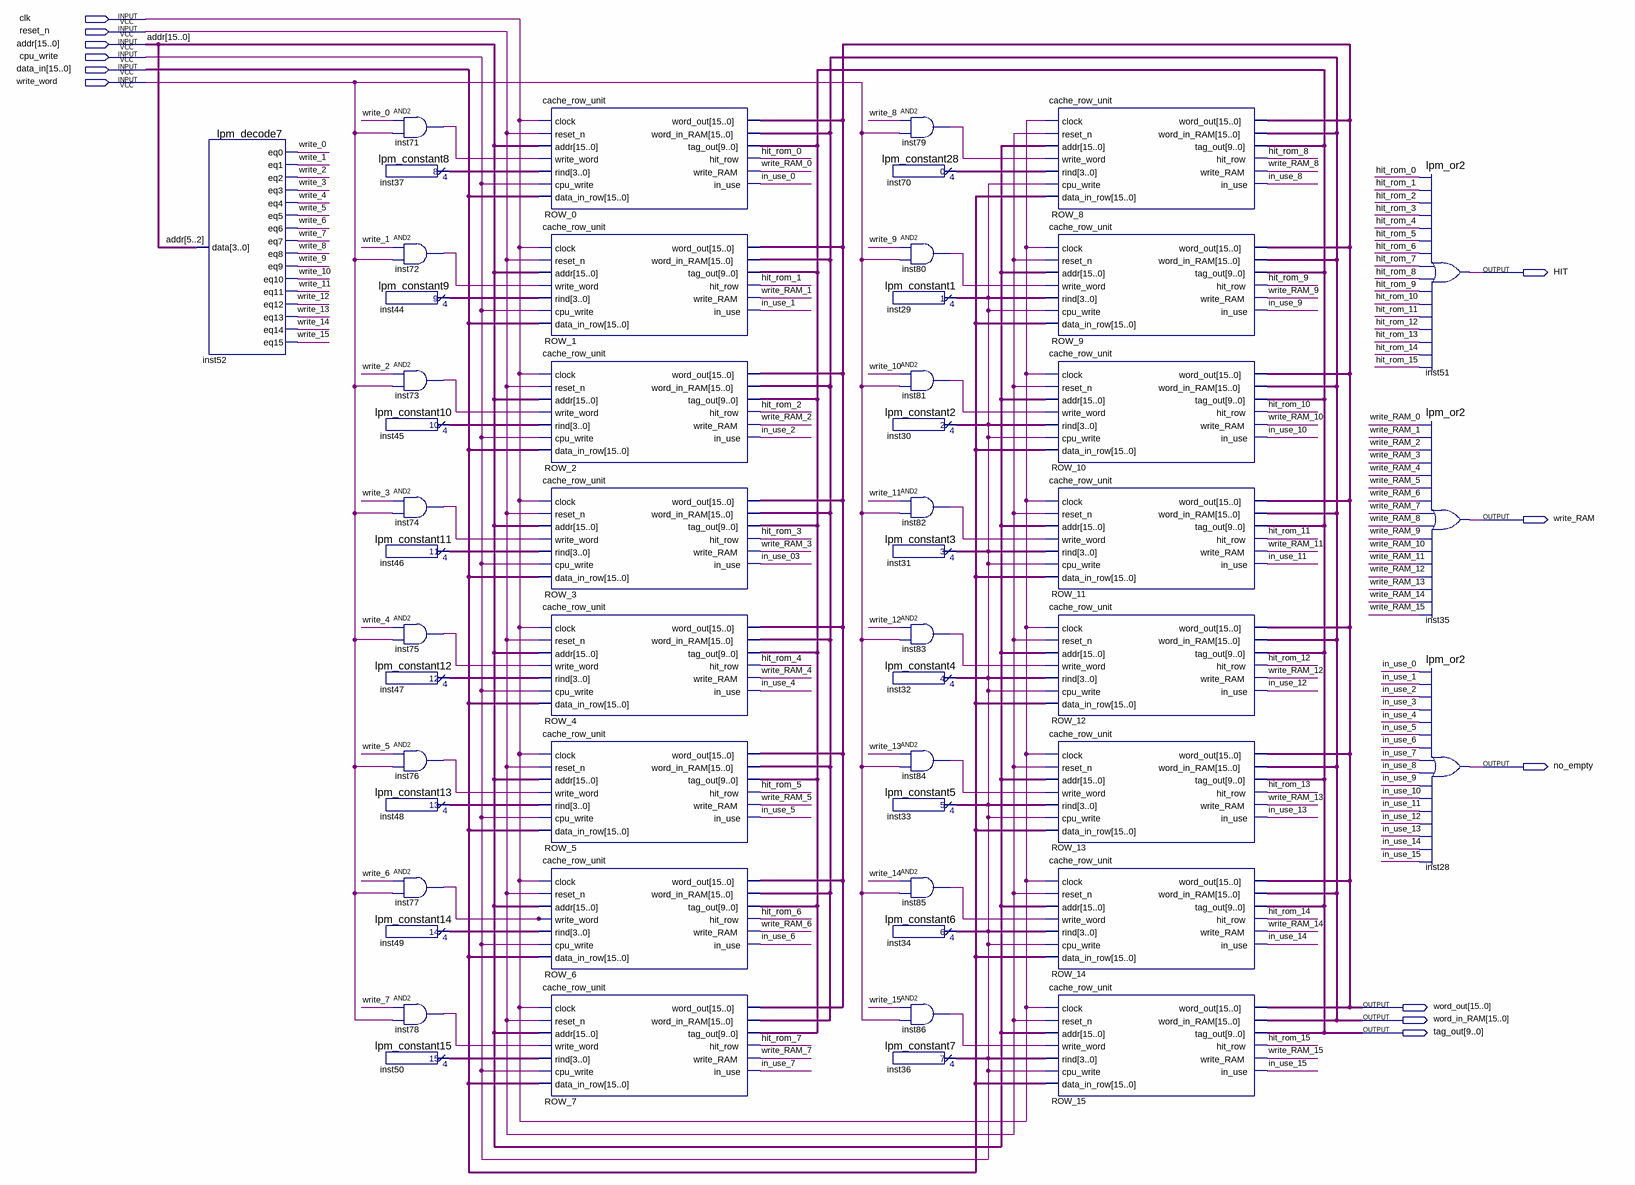
[diagram p0: schematic sheet]
// Quartus schematic cache_bank_unit.bdf as structural Verilog: 52 symbols, 12 pins
module cache_bank_unit (
  input  clk,
  input  reset_n,
  input  [15:0] addr,
  input  cpu_write,
  input  [15:0] data_in,
  input  write_word,
  output HIT,
  output write_RAM,
  output no_empty,
  output [15:0] word_out,
  output [15:0] word_in_RAM,
  output [9:0] tag_out
);

  wire hit_rom_0, hit_rom_1, hit_rom_2, hit_rom_3, hit_rom_4, hit_rom_5, hit_rom_6, hit_rom_7, hit_rom_8,
       hit_rom_9, hit_rom_10, hit_rom_11, hit_rom_12, hit_rom_13, hit_rom_14, hit_rom_15, in_use_0, in_use_1,
       in_use_2, in_use_03, in_use_3, in_use_4, in_use_5, in_use_6, in_use_7, in_use_8, in_use_9, in_use_10,
       in_use_11, in_use_12, in_use_13, in_use_14, in_use_15, inst71_out, inst72_out, inst73_out, inst74_out,
       inst75_out, inst76_out, inst77_out, inst78_out, inst79_out, inst80_out, inst81_out, inst82_out,
       inst83_out, inst84_out, inst85_out, inst86_out, write_0, write_1, write_2, write_3, write_4, write_5,
       write_6, write_7, write_8, write_9, write_10, write_11, write_12, write_13, write_14, write_15,
       write_RAM_0, write_RAM_1, write_RAM_2, write_RAM_3, write_RAM_4, write_RAM_5, write_RAM_6,
       write_RAM_7, write_RAM_8, write_RAM_9, write_RAM_10, write_RAM_11, write_RAM_12, write_RAM_13,
       write_RAM_14, write_RAM_15;
  wire [3:0] inst29_result, inst30_result, inst31_result, inst32_result, inst33_result, inst34_result,
       inst36_result, inst37_result, inst44_result, inst45_result, inst46_result, inst47_result,
       inst48_result, inst49_result, inst50_result, inst70_result;

  lpm_decode7 inst52 (
    .data(addr[5:2]), .eq0(write_0), .eq1(write_1), .eq2(write_2), .eq3(write_3), .eq4(write_4),
    .eq5(write_5), .eq6(write_6), .eq7(write_7), .eq8(write_8), .eq9(write_9), .eq10(write_10),
    .eq11(write_11), .eq12(write_12), .eq13(write_13), .eq14(write_14), .eq15(write_15));
  and inst71 (inst71_out, write_0, write_word);
  lpm_constant8 inst37 (.result(inst37_result));
  and inst72 (inst72_out, write_1, write_word);
  lpm_constant9 inst44 (.result(inst44_result));
  and inst73 (inst73_out, write_2, write_word);
  lpm_constant10 inst45 (.result(inst45_result));
  and inst74 (inst74_out, write_3, write_word);
  lpm_constant11 inst46 (.result(inst46_result));
  and inst75 (inst75_out, write_4, write_word);
  lpm_constant12 inst47 (.result(inst47_result));
  and inst76 (inst76_out, write_5, write_word);
  lpm_constant13 inst48 (.result(inst48_result));
  and inst77 (inst77_out, write_6, write_word);
  lpm_constant14 inst49 (.result(inst49_result));
  and inst78 (inst78_out, write_7, write_word);
  lpm_constant15 inst50 (.result(inst50_result));
  cache_row_unit ROW_0 (
    .clock(clk), .reset_n(reset_n), .addr(addr), .write_word(inst71_out), .rind(inst37_result),
    .cpu_write(cpu_write), .data_in_row(data_in), .word_out(word_out), .word_in_RAM(word_in_RAM),
    .tag_out(tag_out), .hit_row(hit_rom_0), .write_RAM(write_RAM_0), .in_use(in_use_0));
  cache_row_unit ROW_1 (
    .clock(clk), .reset_n(reset_n), .addr(addr), .write_word(inst72_out), .rind(inst44_result),
    .cpu_write(cpu_write), .data_in_row(data_in), .word_out(word_out), .word_in_RAM(word_in_RAM),
    .tag_out(tag_out), .hit_row(hit_rom_1), .write_RAM(write_RAM_1), .in_use(in_use_1));
  cache_row_unit ROW_2 (
    .clock(clk), .reset_n(reset_n), .addr(addr), .write_word(inst73_out), .rind(inst45_result),
    .cpu_write(cpu_write), .data_in_row(data_in), .word_out(word_out), .word_in_RAM(word_in_RAM),
    .tag_out(tag_out), .hit_row(hit_rom_2), .write_RAM(write_RAM_2), .in_use(in_use_2));
  cache_row_unit ROW_3 (
    .clock(clk), .reset_n(reset_n), .addr(addr), .write_word(inst74_out), .rind(inst46_result),
    .cpu_write(cpu_write), .data_in_row(data_in), .word_out(word_out), .word_in_RAM(word_in_RAM),
    .tag_out(tag_out), .hit_row(hit_rom_3), .write_RAM(write_RAM_3), .in_use(in_use_03));
  cache_row_unit ROW_4 (
    .clock(clk), .reset_n(reset_n), .addr(addr), .write_word(inst75_out), .rind(inst47_result),
    .cpu_write(cpu_write), .data_in_row(data_in), .word_out(word_out), .word_in_RAM(word_in_RAM),
    .tag_out(tag_out), .hit_row(hit_rom_4), .write_RAM(write_RAM_4), .in_use(in_use_4));
  cache_row_unit ROW_5 (
    .clock(clk), .reset_n(reset_n), .addr(addr), .write_word(inst76_out), .rind(inst48_result),
    .cpu_write(cpu_write), .data_in_row(data_in), .word_out(word_out), .word_in_RAM(word_in_RAM),
    .tag_out(tag_out), .hit_row(hit_rom_5), .write_RAM(write_RAM_5), .in_use(in_use_5));
  cache_row_unit ROW_6 (
    .clock(clk), .reset_n(reset_n), .addr(addr), .write_word(inst77_out), .rind(inst49_result),
    .cpu_write(cpu_write), .data_in_row(data_in), .word_out(word_out), .word_in_RAM(word_in_RAM),
    .tag_out(tag_out), .hit_row(hit_rom_6), .write_RAM(write_RAM_6), .in_use(in_use_6));
  cache_row_unit ROW_7 (
    .clock(clk), .reset_n(reset_n), .addr(addr), .write_word(inst78_out), .rind(inst50_result),
    .cpu_write(cpu_write), .data_in_row(data_in), .word_out(word_out), .word_in_RAM(word_in_RAM),
    .tag_out(tag_out), .hit_row(hit_rom_7), .write_RAM(write_RAM_7), .in_use(in_use_7));
  and inst79 (inst79_out, write_8, write_word);
  lpm_constant28 inst70 (.result(inst70_result));
  and inst80 (inst80_out, write_9, write_word);
  lpm_constant1 inst29 (.result(inst29_result));
  and inst81 (inst81_out, write_10, write_word);
  lpm_constant2 inst30 (.result(inst30_result));
  and inst82 (inst82_out, write_11, write_word);
  lpm_constant3 inst31 (.result(inst31_result));
  and inst83 (inst83_out, write_12, write_word);
  lpm_constant4 inst32 (.result(inst32_result));
  and inst84 (inst84_out, write_13, write_word);
  lpm_constant5 inst33 (.result(inst33_result));
  and inst85 (inst85_out, write_14, write_word);
  lpm_constant6 inst34 (.result(inst34_result));
  and inst86 (inst86_out, write_15, write_word);
  lpm_constant7 inst36 (.result(inst36_result));
  cache_row_unit ROW_8 (
    .clock(clk), .reset_n(reset_n), .addr(addr), .write_word(inst79_out), .rind(inst70_result),
    .cpu_write(cpu_write), .data_in_row(data_in), .word_out(word_out), .word_in_RAM(word_in_RAM),
    .tag_out(tag_out), .hit_row(hit_rom_8), .write_RAM(write_RAM_8), .in_use(in_use_8));
  cache_row_unit ROW_9 (
    .clock(clk), .reset_n(reset_n), .addr(addr), .write_word(inst80_out), .rind(inst29_result),
    .cpu_write(cpu_write), .data_in_row(data_in), .word_out(word_out), .word_in_RAM(word_in_RAM),
    .tag_out(tag_out), .hit_row(hit_rom_9), .write_RAM(write_RAM_9), .in_use(in_use_9));
  cache_row_unit ROW_10 (
    .clock(clk), .reset_n(reset_n), .addr(addr), .write_word(inst81_out), .rind(inst30_result),
    .cpu_write(cpu_write), .data_in_row(data_in), .word_out(word_out), .word_in_RAM(word_in_RAM),
    .tag_out(tag_out), .hit_row(hit_rom_10), .write_RAM(write_RAM_10), .in_use(in_use_10));
  cache_row_unit ROW_11 (
    .clock(clk), .reset_n(reset_n), .addr(addr), .write_word(inst82_out), .rind(inst31_result),
    .cpu_write(cpu_write), .data_in_row(data_in), .word_out(word_out), .word_in_RAM(word_in_RAM),
    .tag_out(tag_out), .hit_row(hit_rom_11), .write_RAM(write_RAM_11), .in_use(in_use_11));
  cache_row_unit ROW_12 (
    .clock(clk), .reset_n(reset_n), .addr(addr), .write_word(inst83_out), .rind(inst32_result),
    .cpu_write(cpu_write), .data_in_row(data_in), .word_out(word_out), .word_in_RAM(word_in_RAM),
    .tag_out(tag_out), .hit_row(hit_rom_12), .write_RAM(write_RAM_12), .in_use(in_use_12));
  cache_row_unit ROW_13 (
    .clock(clk), .reset_n(reset_n), .addr(addr), .write_word(inst84_out), .rind(inst33_result),
    .cpu_write(cpu_write), .data_in_row(data_in), .word_out(word_out), .word_in_RAM(word_in_RAM),
    .tag_out(tag_out), .hit_row(hit_rom_13), .write_RAM(write_RAM_13), .in_use(in_use_13));
  cache_row_unit ROW_14 (
    .clock(clk), .reset_n(reset_n), .addr(addr), .write_word(inst85_out), .rind(inst34_result),
    .cpu_write(cpu_write), .data_in_row(data_in), .word_out(word_out), .word_in_RAM(word_in_RAM),
    .tag_out(tag_out), .hit_row(hit_rom_14), .write_RAM(write_RAM_14), .in_use(in_use_14));
  cache_row_unit ROW_15 (
    .clock(clk), .reset_n(reset_n), .addr(addr), .write_word(inst86_out), .rind(inst36_result),
    .cpu_write(cpu_write), .data_in_row(data_in), .word_out(word_out), .word_in_RAM(word_in_RAM),
    .tag_out(tag_out), .hit_row(hit_rom_15), .write_RAM(write_RAM_15), .in_use(in_use_15));
  lpm_or2 inst51 (
    .data0(hit_rom_0), .data1(hit_rom_1), .data2(hit_rom_2), .data3(hit_rom_3), .data4(hit_rom_4),
    .data5(hit_rom_5), .data6(hit_rom_6), .data7(hit_rom_7), .data8(hit_rom_8), .data9(hit_rom_9),
    .data10(hit_rom_10), .data11(hit_rom_11), .data12(hit_rom_12), .data13(hit_rom_13), .data14(hit_rom_14),
    .data15(hit_rom_15), .result(HIT));
  lpm_or2 inst35 (
    .data0(write_RAM_0), .data1(write_RAM_1), .data2(write_RAM_2), .data3(write_RAM_3), .data4(write_RAM_4),
    .data5(write_RAM_5), .data6(write_RAM_6), .data7(write_RAM_7), .data8(write_RAM_8), .data9(write_RAM_9),
    .data10(write_RAM_10), .data11(write_RAM_11), .data12(write_RAM_12), .data13(write_RAM_13),
    .data14(write_RAM_14), .data15(write_RAM_15), .result(write_RAM));
  lpm_or2 inst28 (
    .data0(in_use_0), .data1(in_use_1), .data2(in_use_2), .data3(in_use_3), .data4(in_use_4),
    .data5(in_use_5), .data6(in_use_6), .data7(in_use_7), .data8(in_use_8), .data9(in_use_9),
    .data10(in_use_10), .data11(in_use_11), .data12(in_use_12), .data13(in_use_13), .data14(in_use_14),
    .data15(in_use_15), .result(no_empty));
endmodule
